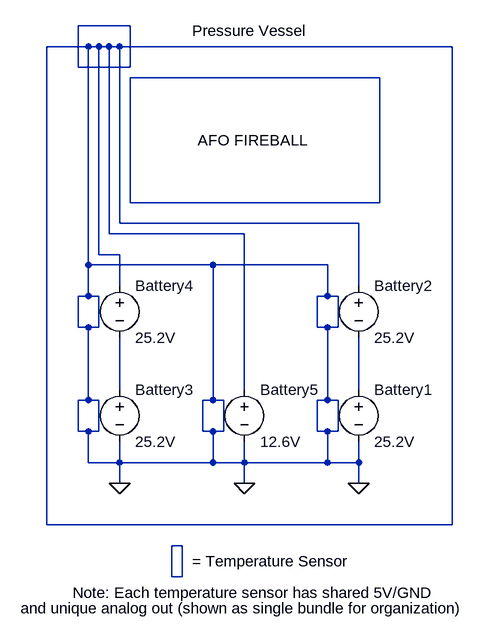
[diagram p0: schematic BatteryBox.asc]
BatteryBox.asc, the LTspice schematic file:
Version 4
SHEET 1 884 680
WIRE -320 -480 -400 -480
WIRE -384 -448 -448 -448
WIRE -368 -448 -384 -448
WIRE -352 -448 -368 -448
WIRE -336 -448 -352 -448
WIRE 176 -448 -336 -448
WIRE -400 -416 -400 -480
WIRE -320 -416 -320 -480
WIRE -320 -416 -400 -416
WIRE 64 -400 -320 -400
WIRE -320 -208 -320 -400
WIRE 64 -208 64 -400
WIRE 64 -208 -320 -208
WIRE -336 -176 -336 -448
WIRE 32 -176 -336 -176
WIRE -352 -160 -352 -448
WIRE -144 -160 -352 -160
WIRE -368 -128 -368 -448
WIRE -336 -128 -368 -128
WIRE -384 -112 -384 -448
WIRE -192 -112 -384 -112
WIRE -16 -112 -192 -112
WIRE -336 -80 -336 -128
WIRE 32 -80 32 -176
WIRE -384 -64 -384 -112
WIRE -384 -64 -400 -64
WIRE -368 -64 -384 -64
WIRE -16 -64 -16 -112
WIRE -16 -64 -32 -64
WIRE 0 -64 -16 -64
WIRE -400 -16 -400 -64
WIRE -384 -16 -400 -16
WIRE -368 -16 -368 -64
WIRE -368 -16 -384 -16
WIRE -32 -16 -32 -64
WIRE -16 -16 -32 -16
WIRE 0 -16 0 -64
WIRE 0 -16 -16 -16
WIRE -336 80 -336 0
WIRE -144 80 -144 -160
WIRE 32 80 32 0
WIRE -384 96 -384 -16
WIRE -384 96 -400 96
WIRE -368 96 -384 96
WIRE -192 96 -192 -112
WIRE -192 96 -208 96
WIRE -176 96 -192 96
WIRE -16 96 -16 -16
WIRE -16 96 -32 96
WIRE 0 96 -16 96
WIRE -400 144 -400 96
WIRE -384 144 -400 144
WIRE -368 144 -368 96
WIRE -368 144 -384 144
WIRE -208 144 -208 96
WIRE -192 144 -208 144
WIRE -176 144 -176 96
WIRE -176 144 -192 144
WIRE -32 144 -32 96
WIRE -16 144 -32 144
WIRE 0 144 0 96
WIRE 0 144 -16 144
WIRE -384 192 -384 144
WIRE -336 192 -336 160
WIRE -336 192 -384 192
WIRE -192 192 -192 144
WIRE -192 192 -336 192
WIRE -144 192 -144 160
WIRE -144 192 -192 192
WIRE -16 192 -16 144
WIRE -16 192 -144 192
WIRE 32 192 32 160
WIRE 32 192 -16 192
WIRE -336 224 -336 192
WIRE -144 224 -144 192
WIRE 32 224 32 192
WIRE -448 288 -448 -448
WIRE 176 288 176 -448
WIRE 176 288 -448 288
WIRE -240 320 -256 320
WIRE -256 368 -256 320
WIRE -240 368 -240 320
WIRE -240 368 -256 368
FLAG 32 224 0
FLAG -336 224 0
FLAG -144 224 0
SYMBOL voltage 32 64 R0
SYMATTR InstName Battery1
SYMATTR Value 25.2V
SYMBOL voltage 32 -96 R0
SYMATTR InstName Battery2
SYMATTR Value 25.2V
SYMBOL voltage -336 64 R0
SYMATTR InstName Battery3
SYMATTR Value 25.2V
SYMBOL voltage -336 -96 R0
SYMATTR InstName Battery4
SYMATTR Value 25.2V
SYMBOL voltage -144 64 R0
SYMATTR InstName Battery5
SYMATTR Value 12.6V
TEXT -216 -304 Left 2 !AFO FIREBALL
TEXT -224 -472 Left 2 !Pressure Vessel
TEXT -224 344 Left 2 != Temperature Sensor
TEXT -408 392 Left 2 !Note: Each temperature sensor has shared 5V/GND
TEXT -488 416 Left 2 !and unique analog out (shown as single bundle for organization)

The netlist it stands for:
* BatteryBox.asc
V§Battery1 N004 0 25.2V
V§Battery2 0 N004 25.2V
V§Battery3 N003 0 25.2V
V§Battery4 0 N003 25.2V
V§Battery5 0 0 12.6V
AFO FIREBALL
Pressure Vessel
= Temperature Sensor
Note: Each temperature sensor has shared 5V/GND
and unique analog out (shown as single bundle for organization)
.backanno
.end